# EAGLE design spdif_B (EAGLE 7.7.0)

## Sheet 1 of 2
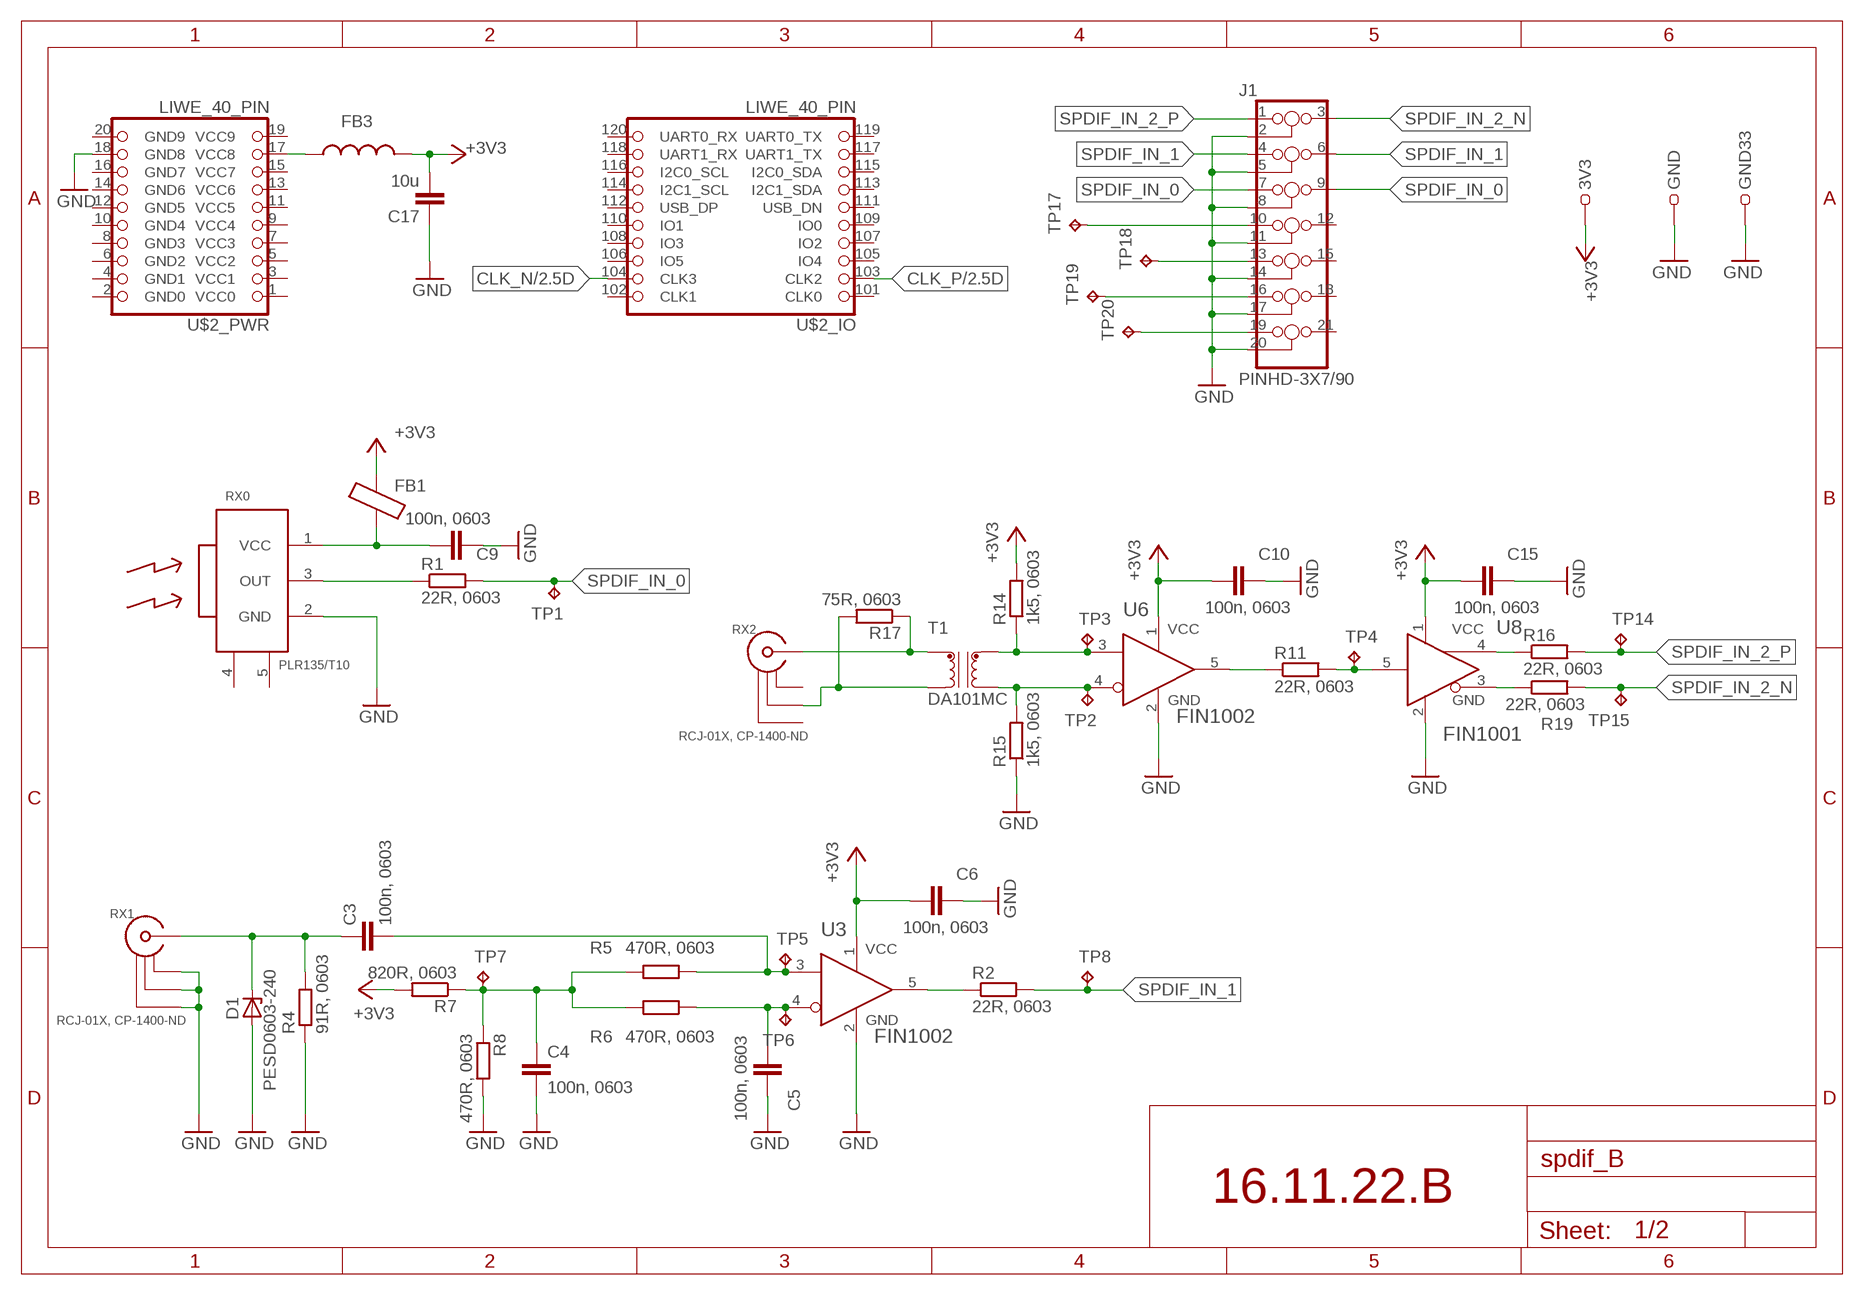
[diagram p0: schematic, sheet 1]

### Parts
3V3  TEST-22-MULTICOMP  [TEST_1MM]
C3  100n, 0603  C-EUC0603  [C0603]
C4  100n, 0603  C-EUC0603  [C0603]
C5  100n, 0603  C-EUC0603  [C0603]
C6  100n, 0603  C-EUC0603  [C0603]
C9  100n, 0603  C-EUC0603  [C0603]
C10  100n, 0603  C-EUC0603  [C0603]
C15  100n, 0603  C-EUC0603  [C0603]
C17  10u  C-EUC0805  [C0805]
D1  PESD0603-240  ZDPESD0603-240  [L0603]
FB1  FB_0603  [L0603]
FB3  L0603(1608)  [L0603]
GND  TEST-22-MULTICOMP  [TEST_1MM]
GND33  TEST-22-MULTICOMP  [TEST_1MM]
J1  PINHD-3X7/90  [3X07/90]
R1  22R, 0603  R-EU_R0603  [R0603]
R2  22R, 0603  R-EU_R0603  [R0603]
R4  91R, 0603  R-EU_R0603  [R0603]
R5  470R, 0603  R-EU_R0603  [R0603]
R6  470R, 0603  R-EU_R0603  [R0603]
R7  820R, 0603  R-EU_R0603  [R0603]
R8  470R, 0603  R-EU_R0603  [R0603]
R11  22R, 0603  R-EU_R0603  [R0603]
R14  1k5, 0603  R-EU_R0603  [R0603]
R15  1k5, 0603  R-EU_R0603  [R0603]
R16  22R, 0603  R-EU_R0603  [R0603]
R17  75R, 0603  R-EU_R0603  [R0603]
R19  22R, 0603  R-EU_R0603  [R0603]
RX0  PLR135/T10  PLR135_T10  [PLR135_T10]
RX1  RCJ-01X, CP-1400-ND  RCJ-01X  [RCJ-01X]
RX2  RCJ-01X, CP-1400-ND  RCJ-01X  [RCJ-01X]
T1  DA101MC  [DA101MC]
TP1  TPB1,27  [B1,27]
TP2  TPB1,27  [B1,27]
TP3  TPB1,27  [B1,27]
TP4  TPB1,27  [B1,27]
TP5  TPB1,27  [B1,27]
TP6  TPB1,27  [B1,27]
TP7  TPB1,27  [B1,27]
TP8  TPB1,27  [B1,27]
TP14  TPB1,27  [B1,27]
TP15  TPB1,27  [B1,27]
TP17  TPB1,27  [B1,27]
TP18  TPB1,27  [B1,27]
TP19  TPB1,27  [B1,27]
TP20  TPB1,27  [B1,27]
U3  FIN1002  [SOT95P280X140-5N]
U6  FIN1002  [SOT95P280X140-5N]
U8  FIN1001  [SOT95P280X140-5N]
U$2  LIWE_40_PIN  [LIWE_40_PIN_8X8]

### Nets
+3V3: 3V3.1 C6.2 C10.2 C15.2 C17.2 FB1.2 FB3.2 R7.2 R14.2 U3.1(VCC) U6.1(VCC) U8.1(VCC) ; also sheet 2
CLK_N: U$2.104(_IO:CLK3) ; also sheet 2
CLK_P: U$2.103(_IO:CLK2) ; also sheet 2
GND: C4.2 C5.1 C6.1 C9.1 C10.1 C15.1 C17.1 D1.1(A) GND33.1 GND.1 J1.2 J1.5 J1.8 J1.11 J1.14 J1.17 J1.20 R4.1 R8.2 R15.1 RX0.2(GND) RX1.20(GND1) RX1.21(GND2) RX1.22(GND3) U3.2(GND) U6.2(GND) U8.2(GND) U$2.18(_PWR:GND8) ; also sheet 2
N$1: R11.2 TP4.TP U8.5(RIN)
N$2: R16.1 U8.4(ROUT+)
N$3: R2.1 U3.5(ROUT)
N$4: C3.2 R5.1 TP5.TP U3.3(RIN+)
N$5: C9.2 FB1.1 RX0.1(VCC)
N$6: C3.1 D1.2(C) R4.2 RX1.1(SIG)
N$7: R19.1 U8.3(ROUT-)
N$11: C4.1 R5.2 R6.2 R7.1 R8.1 TP7.TP
N$12: C5.2 R6.1 TP6.TP U3.4(RIN-)
N$14: J1.10 TP17.TP
N$16: R15.2 T1.4 TP2.TP U6.4(RIN-)
N$17: R14.1 T1.6 TP3.TP U6.3(RIN+)
N$18: J1.13 TP18.TP
N$19: J1.16 TP19.TP
N$20: R17.2 RX2.21(GND2) T1.3
N$21: R17.1 RX2.1(SIG) T1.1
N$22: J1.19 TP20.TP
N$23: FB3.1 U$2.17(_PWR:VCC8)
SPDIF0_IN: R1.1 RX0.3(OUT)
SPDIF_IN_0: J1.7 J1.9 R1.2 TP1.TP
SPDIF_IN_1: J1.4 J1.6 R2.2 TP8.TP
SPDIF_IN_2_N: J1.3 R19.2 TP15.TP
SPDIF_IN_2_P: J1.1 R16.2 TP14.TP
U6_OUT: R11.1 U6.5(ROUT)
Unconnected: J1.12 J1.15 J1.18 J1.21 RX0.4(NC0) RX0.5(NC1) RX2.20(GND1) RX2.22(GND3) U$2.1(_PWR:VCC0) U$2.2(_PWR:GND0) U$2.3(_PWR:VCC1) U$2.4(_PWR:GND1) U$2.5(_PWR:VCC2) U$2.6(_PWR:GND2) U$2.7(_PWR:VCC3) U$2.8(_PWR:GND3) U$2.9(_PWR:VCC4) U$2.10(_PWR:GND4) U$2.11(_PWR:VCC5) U$2.12(_PWR:GND5) U$2.13(_PWR:VCC6) U$2.14(_PWR:GND6) U$2.15(_PWR:VCC7) U$2.16(_PWR:GND7) U$2.19(_PWR:VCC9) U$2.20(_PWR:GND9) U$2.101(_IO:CLK0) U$2.102(_IO:CLK1) U$2.105(_IO:IO4) U$2.106(_IO:IO5) U$2.107(_IO:IO2) U$2.108(_IO:IO3) U$2.109(_IO:IO0) U$2.110(_IO:IO1) U$2.111(_IO:USB_DN) U$2.112(_IO:USB_DP) U$2.113(_IO:I2C1_SDA) U$2.114(_IO:I2C1_SCL) U$2.115(_IO:I2C0_SDA) U$2.116(_IO:I2C0_SCL) U$2.117(_IO:UART1_TX) U$2.118(_IO:UART1_RX) U$2.119(_IO:UART0_TX) U$2.120(_IO:UART0_RX)

### Notes on the sheet
- 16.11.22.B

## Sheet 2 of 2
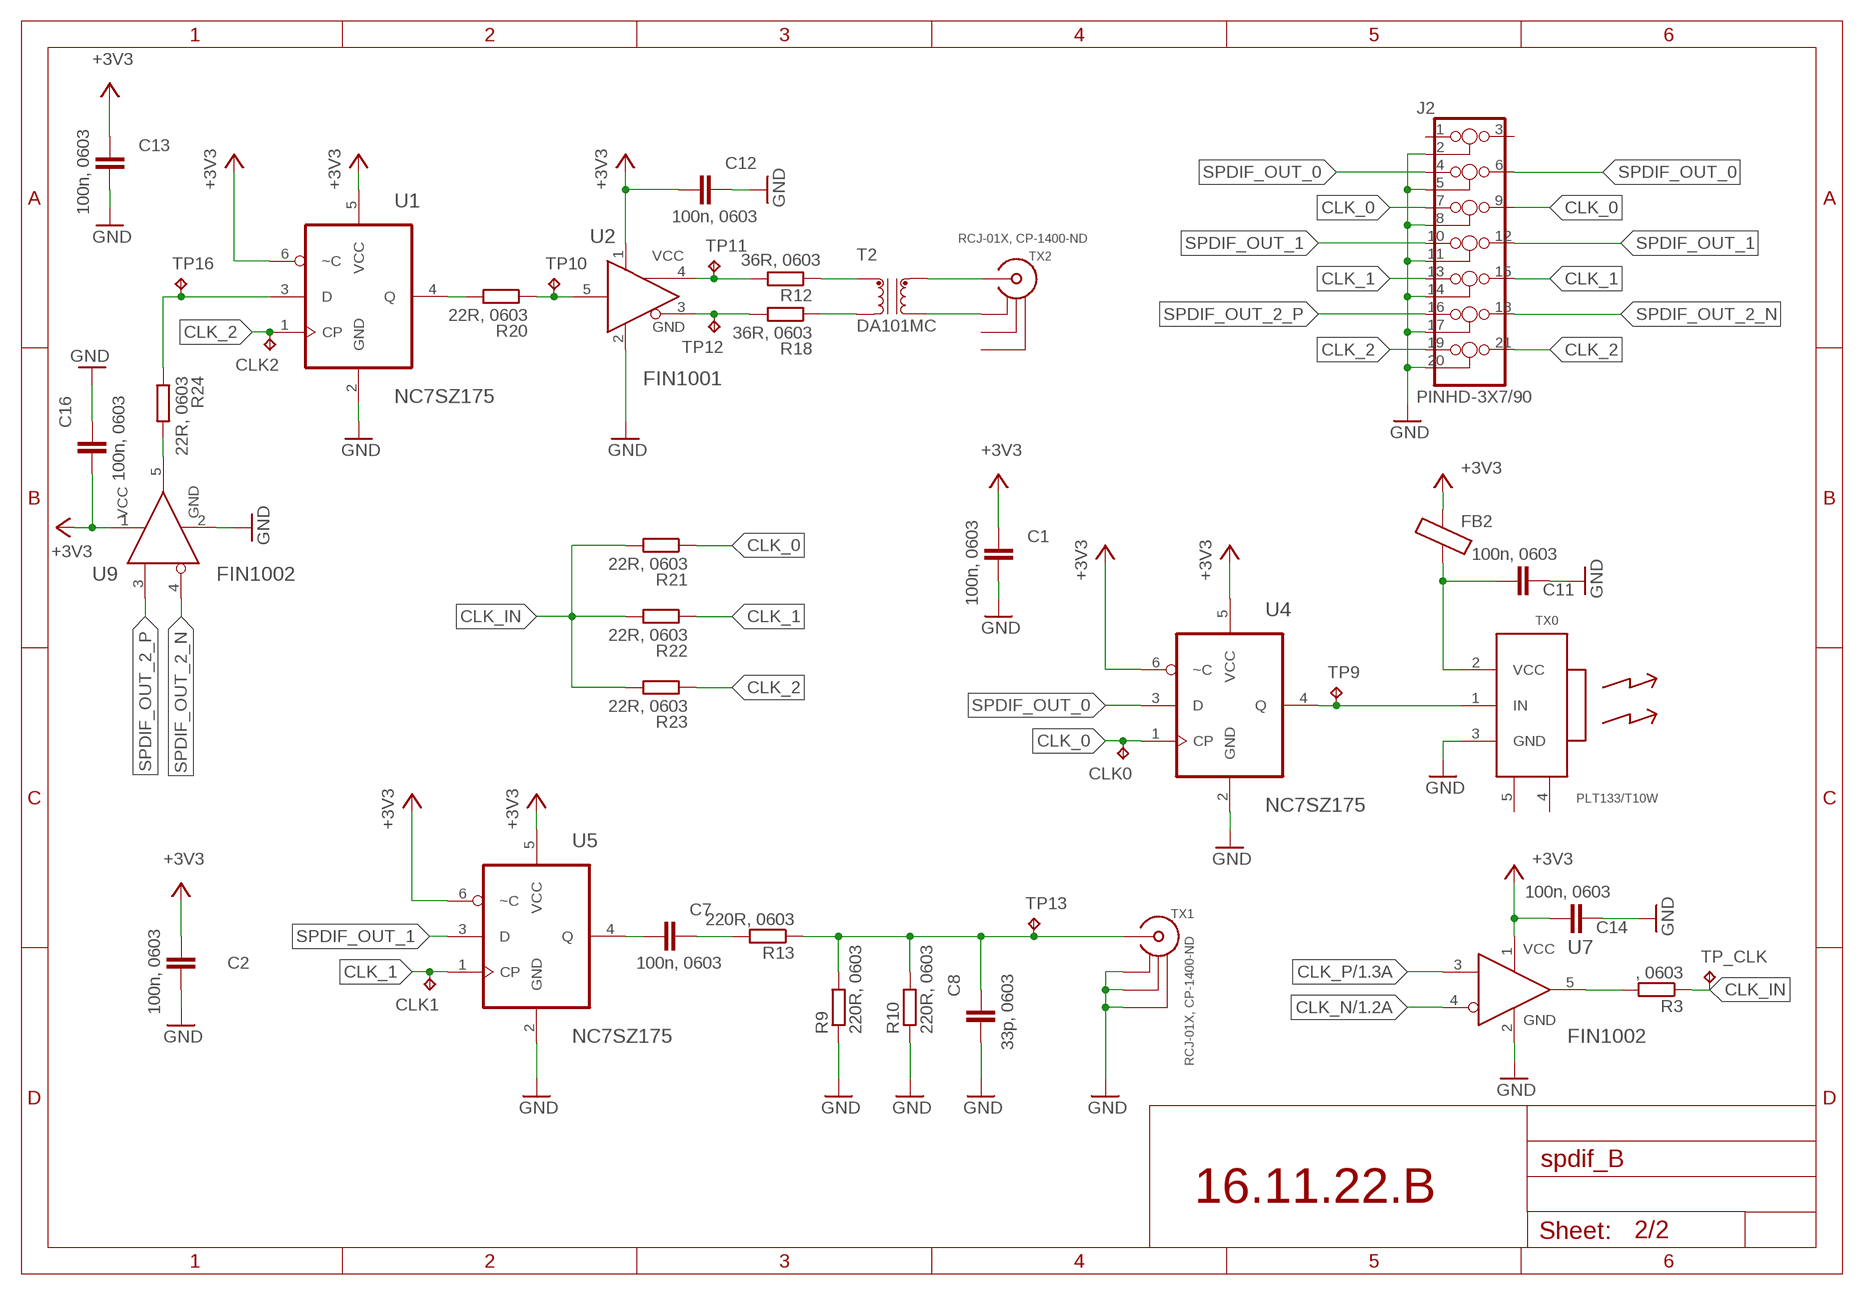
[diagram p1: schematic, sheet 2]

### Parts
C1  100n, 0603  C-EUC0603  [C0603]
C2  100n, 0603  C-EUC0603  [C0603]
C7  100n, 0603  C-EUC0603  [C0603]
C8  33p, 0603  C-EUC0603  [C0603]
C11  100n, 0603  C-EUC0603  [C0603]
C12  100n, 0603  C-EUC0603  [C0603]
C13  100n, 0603  C-EUC0603  [C0603]
C14  100n, 0603  C-EUC0603  [C0603]
C16  100n, 0603  C-EUC0603  [C0603]
CLK0  TPB1,27  [B1,27]
CLK1  TPB1,27  [B1,27]
CLK2  TPB1,27  [B1,27]
FB2  FB_0603  [L0603]
J2  PINHD-3X7/90  [3X07/90]
R3  , 0603  R-EU_R0603  [R0603]
R9  220R, 0603  R-EU_R0603  [R0603]
R10  220R, 0603  R-EU_R0603  [R0603]
R12  36R, 0603  R-EU_R0603  [R0603]
R13  220R, 0603  R-EU_R0603  [R0603]
R18  36R, 0603  R-EU_R0603  [R0603]
R20  22R, 0603  R-EU_R0603  [R0603]
R21  22R, 0603  R-EU_R0603  [R0603]
R22  22R, 0603  R-EU_R0603  [R0603]
R23  22R, 0603  R-EU_R0603  [R0603]
R24  22R, 0603  R-EU_R0603  [R0603]
T2  DA101MC  [DA101MC]
TP9  TPB1,27  [B1,27]
TP10  TPB1,27  [B1,27]
TP11  TPB1,27  [B1,27]
TP12  TPB1,27  [B1,27]
TP13  TPB1,27  [B1,27]
TP16  TPB1,27  [B1,27]
TP_CLK  TPB1,27  [B1,27]
TX0  PLT133/T10W  PLT133_T10W  [PLT133_T10W]
TX1  RCJ-01X, CP-1400-ND  RCJ-01X  [RCJ-01X]
TX2  RCJ-01X, CP-1400-ND  RCJ-01X  [RCJ-01X]
U1  NC7SZ175  [SOT65P210X110-6N]
U2  FIN1001  [SOT95P280X140-5N]
U4  NC7SZ175  [SOT65P210X110-6N]
U5  NC7SZ175  [SOT65P210X110-6N]
U7  FIN1002  [SOT95P280X140-5N]
U9  FIN1002  [SOT95P280X140-5N]

### Nets
+3V3: C1.2 C2.2 C12.2 C13.2 C14.2 C16.2 FB2.2 U1.5(VCC) U1.6(~C) U2.1(VCC) U4.5(VCC) U4.6(~C) U5.5(VCC) U5.6(~C) U7.1(VCC) U9.1(VCC) ; also sheet 1
CLK_0: CLK0.TP J2.7 J2.9 R21.1 U4.1(CP)
CLK_1: CLK1.TP J2.13 J2.15 R22.1 U5.1(CP)
CLK_2: CLK2.TP J2.19 J2.21 R23.1 U1.1(CP)
CLK_IN: R3.1 R21.2 R22.2 R23.2 TP_CLK.TP
CLK_N: U7.4(RIN-) ; also sheet 1
CLK_P: U7.3(RIN+) ; also sheet 1
DA_N: R18.1 T2.3
DA_P: R12.1 T2.1
FIN_IN: R20.1 TP10.TP U2.5(RIN)
FIN_OUT_N: R18.2 TP12.TP U2.3(ROUT-)
FIN_OUT_P: R12.2 TP11.TP U2.4(ROUT+)
GND: C1.1 C2.1 C8.2 C11.1 C12.1 C13.1 C14.1 C16.1 J2.2 J2.5 J2.8 J2.11 J2.14 J2.17 J2.20 R9.1 R10.1 TX0.3(GND) TX1.20(GND1) TX1.21(GND2) TX1.22(GND3) U1.2(GND) U2.2(GND) U4.2(GND) U5.2(GND) U7.2(GND) U9.2(GND) ; also sheet 1
N$8: R24.2 U9.5(ROUT)
N$9: R3.2 U7.5(ROUT)
N$10: R24.1 TP16.TP U1.3(D)
N$13: C7.1 R13.2
N$15: C7.2 U5.4(Q)
Q: R20.2 U1.4(Q)
SPDIF_OUT_0: J2.4 J2.6 U4.3(D)
SPDIF_OUT_1: J2.10 J2.12 U5.3(D)
SPDIF_OUT_2_N: J2.18 U9.4(RIN-)
SPDIF_OUT_2_P: J2.16 U9.3(RIN+)
TX0_IN: TP9.TP TX0.1(IN) U4.4(Q)
TX0_VCC: C11.2 FB2.1 TX0.2(VCC)
TX1_IN: C8.1 R9.2 R10.2 R13.1 TP13.TP TX1.1(SIG)
TX2_N: T2.4 TX2.20(GND1)
TX2_P: T2.6 TX2.1(SIG)
Unconnected: J2.1 J2.3 TX0.4(NC0) TX0.5(NC1) TX2.21(GND2) TX2.22(GND3)

### Notes on the sheet
- 16.11.22.B

## Library data of the parts
3V3 GND GND33 = 25cmsquare:TEST-22-MULTICOMP: MULTICOMP TEST-22 TEST PIN, PCB, 1.0MM FARNELL: 1702010
C1-C17 = rcl:C-EU: CAPACITOR, European symbol
CLK0 CLK1 CLK2 TP1-TP20 TP_CLK = testpad:TP: Test pad
D1 = 25cmsquare:ZD
FB1 FB2 = 25cmsquare:FB
FB3 = 25cmsquare:L
J1 J2 = 25pinhead:PINHD-3X7
R1-R24 = rcl:R-EU_: RESISTOR, European symbol
RX0 = 25cmsquare:PLR135_T10
RX1 RX2 TX1 TX2 = 25cmsquare:RCJ-01X
T1 T2 = 25cmsquare:DA
TX0 = 25cmsquare:PLT133_T10W
U1 U4 U5 = 25cmsquare:NC7SZ175
U2 U8 = 25cmsquare:FIN1001
U3 U6 U7 U9 = 25cmsquare:FIN1002
U$2 = 25cmsquare:LIWE_40_PIN

## Board
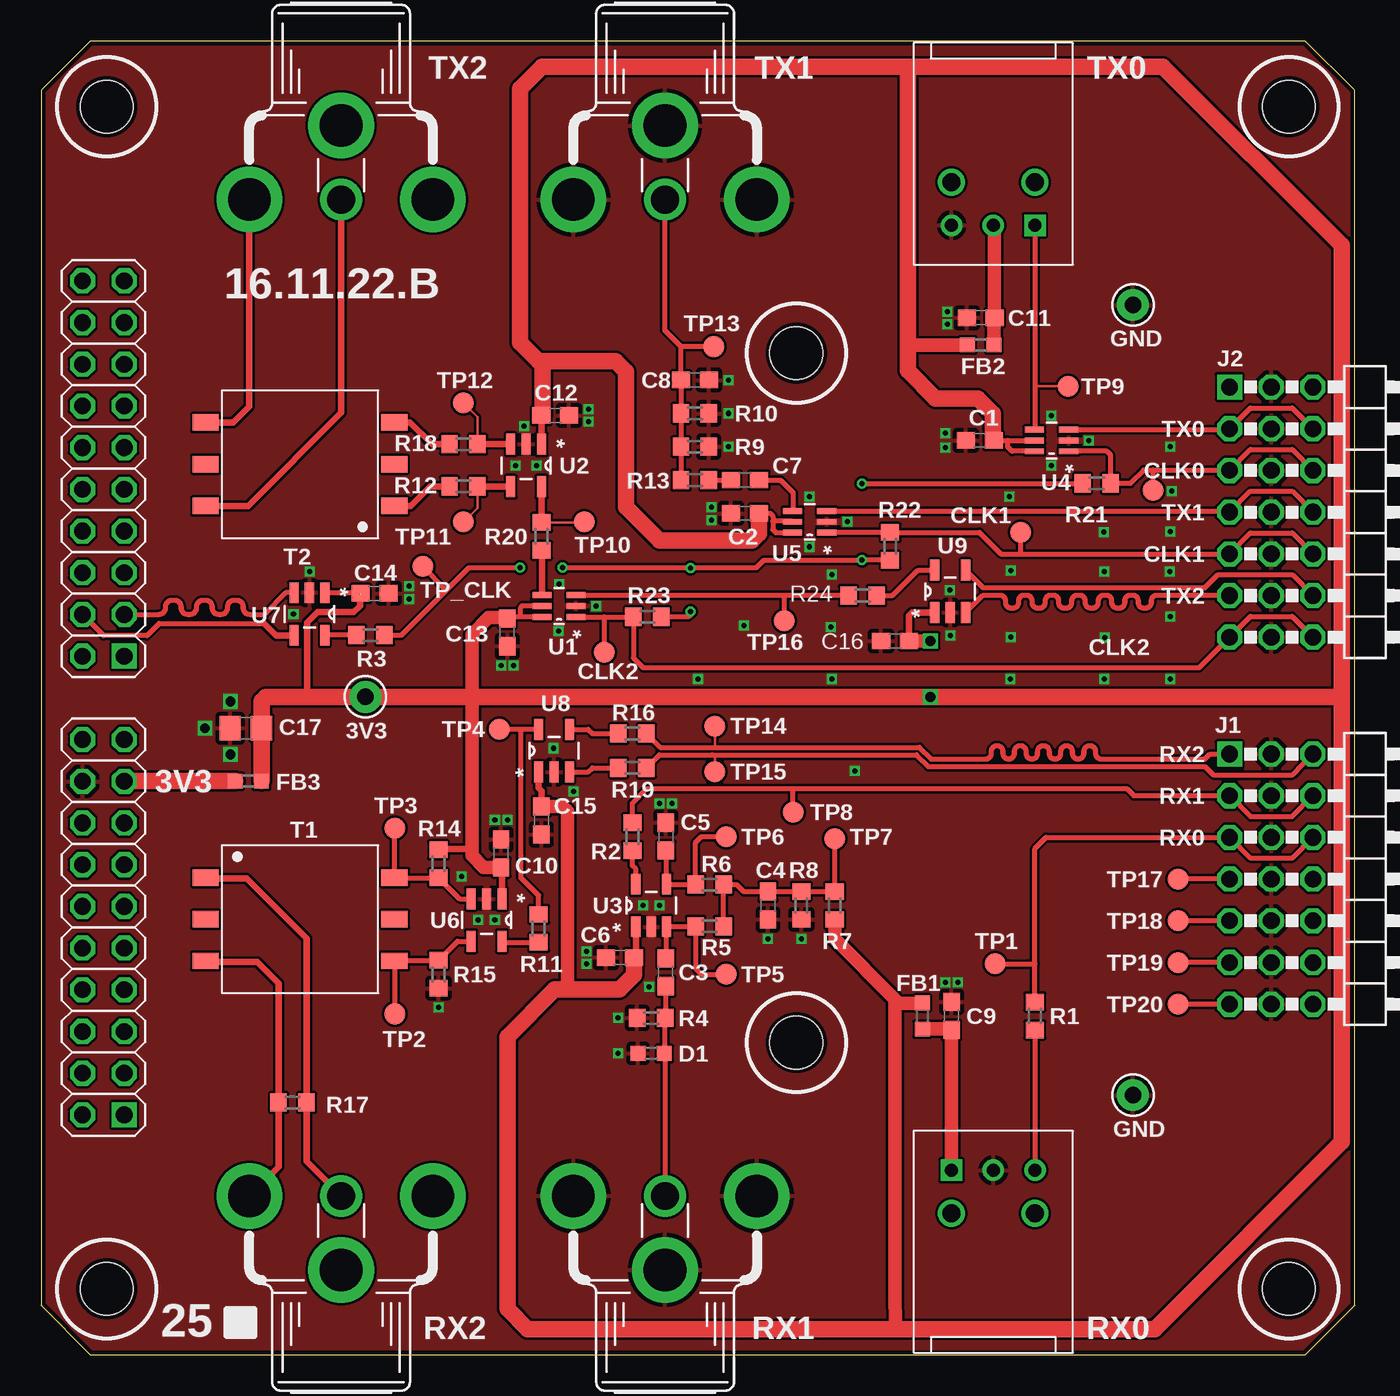
[diagram p2: board, top side]
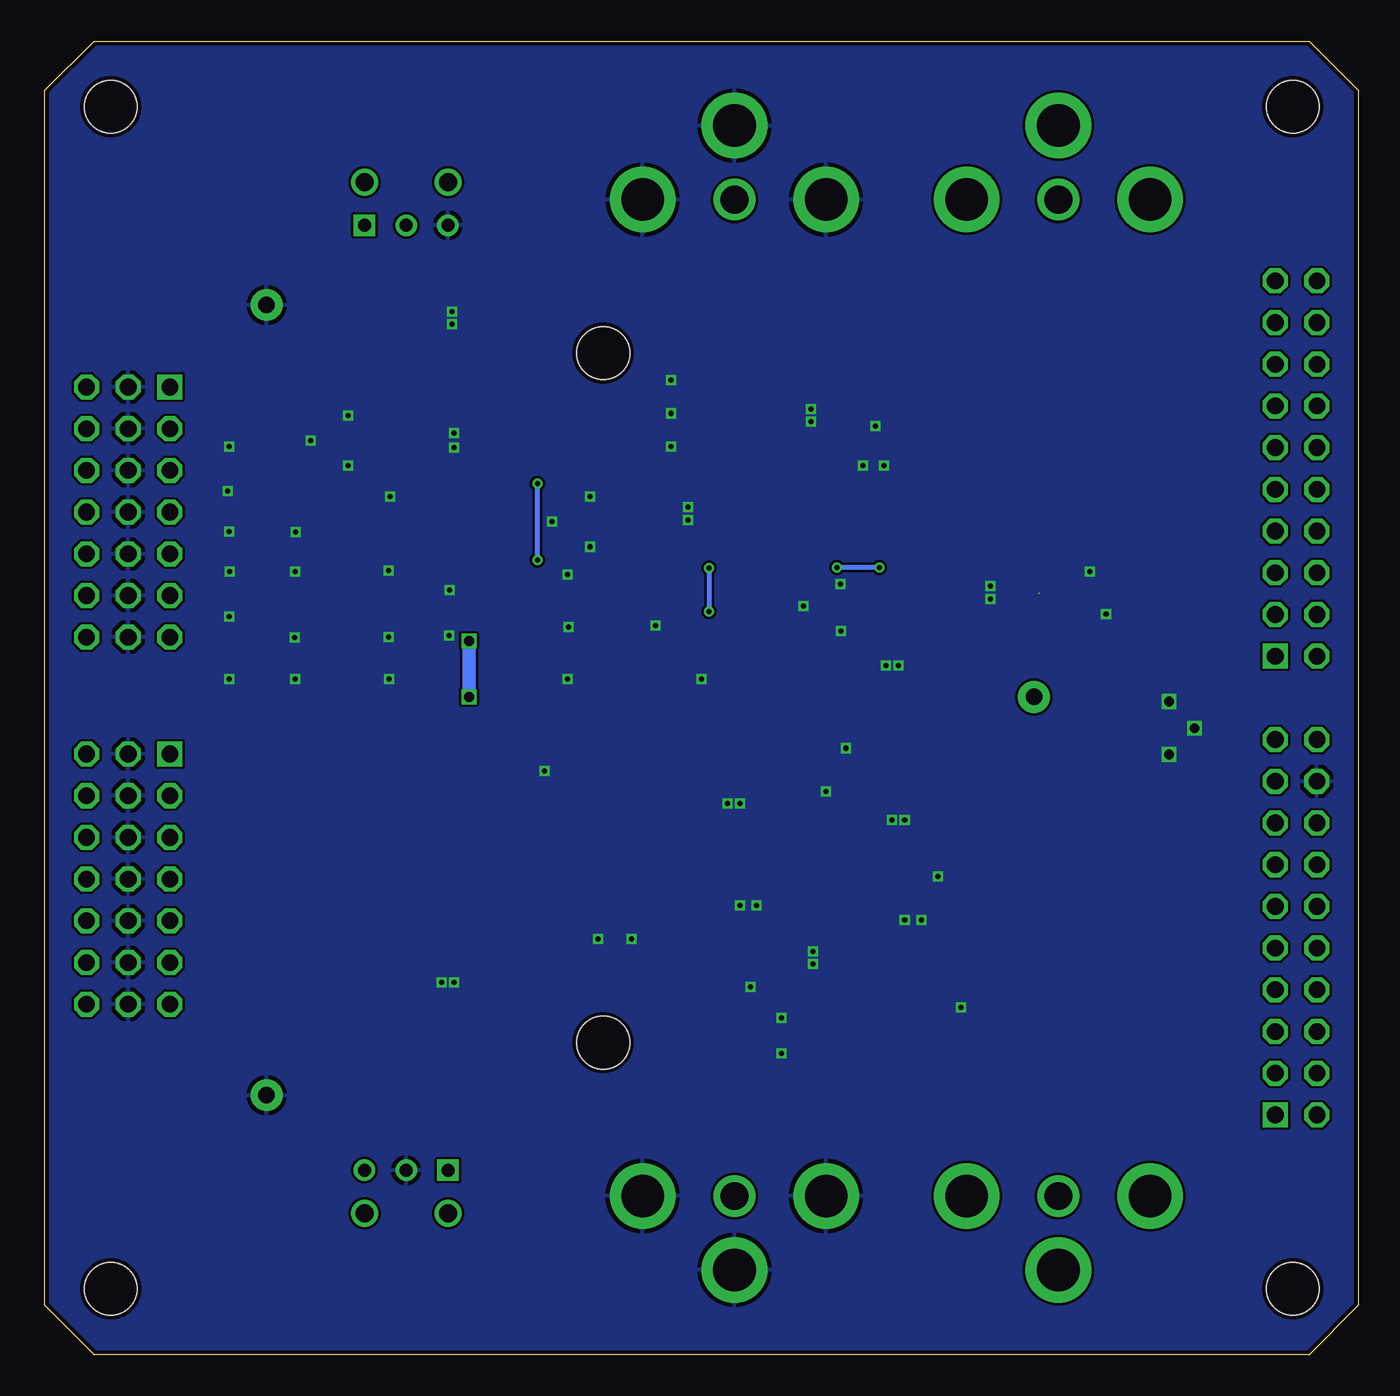
[diagram p3: board, bottom side, seen from below]

Size 80 x 80 mm. Coordinates in mm from the lower left corner, seen from the top.
Copper layers (1*16): Top 0.035mm / dielectric 1.5mm / Bottom 0.035mm
Design rules "SeeedStudio_2layer_DRU_no_angle_20140221": minimum track width 6mil, minimum drill 12mil, track to track 6mil, track to pad 6mil, pad to pad 6mil, via to via 6mil, smd to smd 0mil, copper to edge 10mil, drill to drill 10mil, minimum pad ring 10mil, minimum via ring 6mil, stop-mask expansion 2mil, vias tented up to drill 100mil, thermal gap 10mil

### Footprints (pad centres in the part's own frame; a part is rotated, then mirrored left to right if it is on the bottom)
TEST_1MM = drill 1 pad 1.93: 1 0,0
C0603 = smd 1.1 x 1: 1 -0.85,0; 2 0.85,0
C0805 = smd 1.3 x 1.5: 1 -0.95,0; 2 0.95,0
B1,27 = smd 1.27 x 1.27: TP 0,0
L0603 = smd 0.9 x 0.9: 1 -0.8,0; 2 0.8,0
3X07/90 = drill 1.016 square: 1 -7.62,-8.89 | drill 1.016 octagon: 2 -7.62,-6.35; 3 -7.62,-3.81; 4 -5.08,-8.89; 5 -5.08,-6.35; 6 -5.08,-3.81; 7 -2.54,-8.89; 8 -2.54,-6.35; 9 -2.54,-3.81; 10 0,-8.89; 11 0,-6.35; 12 0,-3.81; 13 2.54,-8.89; 14 2.54,-6.35; 15 2.54,-3.81; 16 5.08,-8.89; 17 5.08,-6.35; 18 5.08,-3.81; 19 7.62,-8.89; 20 7.62,-6.35; 21 7.62,-3.81
R0603 = smd 1 x 1.1: 1 -0.85,0; 2 0.85,0
PLR135_T10 = drill 0.8 square: 1 2.54,0 | drill 0.8: 2 0,0; 3 -2.54,0 | drill 1.1: 4 2.54,2.62; 5 -2.54,2.62
RCJ-01X = drill 1.7 pad 2.54: 1 0,0 | drill 2.6 pad 4: 20 -5.588,0; 21 5.588,0; 22 0,4.5
DA101MC = smd 1.6 x 1: 1 -5.75,2.54; 2 -5.75,0; 3 -5.75,-2.54; 4 5.75,-2.54; 5 5.75,0; 6 5.75,2.54
PLT133_T10W = drill 0.8 square: 1 2.54,0 | drill 0.8: 2 0,0; 3 -2.54,0 | drill 1.1: 4 2.54,2.63; 5 -2.54,2.63
SOT65P210X110-6N = smd 1.168 x 0.356: 1 -1.041,0.66; 2 -1.041,0; 3 -1.041,-0.66; 4 1.041,-0.66; 5 1.041,0; 6 1.041,0.66
SOT95P280X140-5N = smd 1.27 x 0.559: 1 -1.295,0.94; 2 -1.295,0; 3 -1.295,-0.94; 4 1.295,-0.94; 5 1.295,0.94
LIWE_40_PIN_8X8 = drill 1.016 square: 1 74.93,65.405; 101 74.93,37.465 | drill 1.016 octagon: 2 77.47,65.405; 3 74.93,62.865; 4 77.47,62.865; 5 74.93,60.325; 6 77.47,60.325; 7 74.93,57.785; 8 77.47,57.785; 9 74.93,55.245; 10 77.47,55.245; 11 74.93,52.705; 12 77.47,52.705; 13 74.93,50.165; 14 77.47,50.165; 15 74.93,47.625; 16 77.47,47.625; 17 74.93,45.085; 18 77.47,45.085; 19 74.93,42.545; 20 77.47,42.545; 102 77.47,37.465; 103 74.93,34.925; 104 77.47,34.925; 105 74.93,32.385; 106 77.47,32.385; 107 74.93,29.845; 108 77.47,29.845; 109 74.93,27.305; 110 77.47,27.305; 111 74.93,24.765; 112 77.47,24.765; 113 74.93,22.225; 114 77.47,22.225; 115 74.93,19.685; 116 77.47,19.685; 117 74.93,17.145; 118 77.47,17.145; 119 74.93,14.605; 120 77.47,14.605 | hole 3.2: 34,19; 34,61; 4,76; 4,4; 76,4; 76,76

### Placement (x,y rotation side)
3V3  19.76,40.05 0 top
C1  57.17,55.67 0 top
C2  42.87,51.23 0 top
C3  38.05,23.29 90 top
C4  44.27,27.35 270 top
C5  38.05,31.54 270 top
C6  35.26,24.18 0 top
C7  42.88,53.26 0 top
C8  39.83,59.36 0 top
C9  55.45,20.62 270 top
C10  28.02,30.53 270 top
C11  57.23,63.14 0 top
C12  31.32,57.2 180 top
C13  28.4,43.99 90 top
C14  20.32,46.35 180 top
C15  30.48,32.54 90 top
C16  52.02,43.46 0 top
C17  12.47,38.15 0 top
CLK0  67.74,52.63 0 top
CLK1  59.66,50.09 0 top
CLK2  34.32,42.77 0 top
D1  37.16,18.34 0 top
FB1  53.67,20.62 90 top
FB2  57.23,61.49 180 top
FB3  12.62,34.92 0 top
GND  66.5,15.79 0 top
GND33  66.5,63.93 0 top
J1  81.28,28.96 270 top
J2  81.28,51.31 270 top
R1  60.53,20.62 90 top
R2  36.02,31.54 90 top
R3  20.07,43.81 180 top
R4  37.16,20.49 0 top
R5  40.72,26.08 0 top
R6  40.72,28.62 0 top
R7  48.34,27.35 270 top
R8  46.31,27.35 270 top
R9  39.83,55.29 180 top
R10  39.83,57.32 180 top
R11  30.3,25.95 90 top
R12  25.73,52.88 0 top
R13  39.83,53.26 0 top
R14  24.21,29.89 90 top
R15  24.21,23.16 90 top
R16  36.02,37.82 0 top
R17  15.32,15.35 180 top
R18  25.73,55.44 0 top
R19  36.02,35.74 0 top
R20  30.48,49.83 270 top
R21  64.29,53.06 180 top
R22  51.71,49.23 270 top
R23  36.93,44.93 0 top
R24  50.04,46.23 0 top
RX0  58,11.22 180 top
RX1  38.01,9.65 180 top
RX2  18.27,9.65 180 top
T1  15.78,26.51 0 top
T2  15.78,54.22 180 top
TP1  58.12,23.8 0 top
TP2  21.54,20.75 0 top
TP3  21.54,32.05 0 top
TP4  27.91,38.07 0 top
TP5  41.73,23.16 0 top
TP6  41.73,31.54 0 top
TP7  48.34,31.42 0 top
TP8  45.8,33.04 0 top
TP9  62.56,58.98 0 top
TP10  33.1,50.72 0 top
TP11  25.73,50.72 0 top
TP12  25.73,57.96 0 top
TP13  40.97,61.39 0 top
TP14  41.05,38.28 0 top
TP15  41.05,35.48 0 top
TP16  45.26,44.68 0 top
TP17  69.27,28.96 0 top
TP18  69.27,26.42 0 top
TP19  69.27,23.88 0 top
TP20  69.27,21.34 0 top
TP_CLK  23.24,48.01 0 top
TX0  58,68.78 0 top
TX1  38.01,70.35 0 top
TX2  18.27,70.35 0 top
U1  31.55,45.59 180 top
U2  29.54,54.15 270 top
U3  37.16,27.35 90 top
U4  61.55,55.67 180 top
U5  46.81,50.72 180 top
U6  27.13,26.46 270 top
U7  16.35,45.1 270 top
U8  31.24,36.78 90 top
U9  55.37,46.48 90 top
U$2  80,80 180 top

### Tracks (layer width: path | path; a pad name or v marks a point on that pad's centre or on a via)
+3V3  (via drill 0.6)  (1 unrouted)
  Top 0.254: 52.73,78.51 52.73,78.45
  Top 0.305: U1.6 29.18,44.93 | 29.18,44.93 28.11,44.93 C13.2 | 26.24,43.86 26.24,40.13 | U7.1 19.43,46.4 C14.2 | C2.2 44.42,51.23 44.58,51.08 44.58,50.75 | 44.58,50.75 44.58,50.24 44.76,50.06 U5.6 | U5.5 45.74,50.75 44.58,50.75 | U1.5 29.31,45.59 29.18,45.47 29.18,44.93 | C1.2 58.88,55.67 | 58.88,55.67 U4.5 | U4.6 59.13,55.02 58.88,55.27 58.88,55.67
  Top 0.406: U2.1 30.47,55.46 C12.2 | R14.2 24.25,30.78 26.24,30.78 | C10.2 28.07,29.63 U6.1 | U3.1 36.22,24.14 C6.2 | 19.43,46.35 19.43,45.59 19.05,45.21 16.84,45.21 16.2,44.58 16.2,40.13 15.68,40.13 15.6,40.05 | U8.1 30.3,34.49 30.48,34.31 C15.2 | U9.1 53.03,45.19 52.86,45.01 52.86,43.47 C16.2
  Top 0.813: C13.2 27.98,44.88 27.26,44.88 26.24,43.86 26.24,40.05 26.24,30.78 26.24,30.4 26.96,29.68 C10.2 | R7.2 48.34,25.32 52.02,21.64 52.02,21.38 | 52.02,21.38 52.02,3.97 52.03,1.55 | FB1.2 53.63,21.38 52.02,21.38 | 52.78,60.85 52.78,61.49 FB2.2 | C15.2 31.74,33.39 32.05,33.07 32.05,22.23 | C16.2 v54.18,43.46
  Top 1.016: 79.22,40.05 v54.18,40.05 26.24,40.05 3V3.1 15.6,40.05 13.69,40.05 13.44,39.8 13.44,38.17 C17.2 FB3.2 | 30.56,60.5 30.3,60.5 29.16,61.64 29.16,77.1 30.51,78.45 52.73,78.45 | 30.56,60.5 35,60.5 35.64,59.86 35.64,51.61 37.67,49.58 43.31,49.58 43.72,49.99 C2.2 | C12.2 30.56,57.24 30.56,60.5 | C6.2 36.11,23.12 35.22,22.23 32.05,22.23 31.28,22.23 28.4,19.35 28.4,2.77 29.62,1.55 52.03,1.55 67.83,1.55 79.22,12.95 79.22,40.05 | 79.22,40.05 79.22,67.56 68.34,78.45 52.73,78.45 | 52.73,78.45 52.7,78.44 52.78,78.36 52.78,60.85 52.78,59.92 54.48,58.22 57.07,58.22 57.99,57.3 57.99,55.71 C1.2
  Bottom 0.813: v54.18,43.46 v54.18,40.05
CLK_0
  Top 0.305: U4.1 64.93,55.01 65.13,54.81 65.13,53.07 | 72.35,53.81 J2.7 | J2.7 73.66,55.12 76.2,55.12 J2.9 | 65.13,53.07 R21.1 | 65.13,53.07 66.36,53.07 67.16,53.87 67.74,53.87 | 67.74,53.87 71.86,53.87 71.88,53.85 J2.7 | CLK0.TP 67.74,53.87
CLK_1
  Top 0.305: U5.1 51.7,50.06 R22.1 57.16,50.08 58.47,48.77 59.64,48.77 | 72.35,48.73 J2.13 | J2.13 73.66,50.04 76.2,50.04 J2.15 | 59.64,48.77 J2.13 | CLK1.TP 59.64,50.06 59.64,48.77
CLK_2
  Top 0.305: 72.35,43.65 J2.19 | J2.19 73.66,44.96 76.2,44.96 J2.21 | CLK2.TP 34.31,44.9 34.29,44.93 | U1.1 34.29,44.93 | 34.29,44.93 R23.1 36.08,42.43 36.68,41.83 70.54,41.83 J2.19
CLK_IN  (via drill 0.3)
  Top 0.305: R3.1 21.95,43.81 24.68,46.55 | 24.68,46.55 26.06,47.93 v29.18,47.93 | TP_CLK.TP 23.24,47.98 24.68,46.55 | v31.75,47.93 39.55,47.93 | 39.55,47.93 v39.55,47.9 | v39.55,45.26 39.55,45.05 39.43,44.93 R23.2 | 39.55,47.93 43.56,47.93 44.02,48.39 v50.01,48.39 R22.2 | v50.01,53.06 R21.2
  Bottom 0.305: v29.18,47.93 v31.75,47.93 | v39.55,47.9 v39.55,45.26 | v50.01,48.39 v50.01,53.06
CLK_N
  Top 0.305: 13.59,44.53 7.19,44.53 6.45,43.79 3.81,43.79 U$2.104
  Top 0.406: U7.4 14.31,43.81 13.59,44.53
CLK_P
  Top 0.305: U7.3 14.9,46.4 13.59,45.09 12.7,45.09 arc-90 12.31,45.48 12.31,45.55 arc90 11.91,45.94 11.76,45.94 arc90 11.36,45.55 11.36,45.48 arc-90 10.97,45.09 10.81,45.09 arc-90 10.42,45.48 10.42,45.55 arc90 10.02,45.94 9.87,45.94 arc90 9.47,45.55 9.47,45.48 arc-90 9.08,45.09 8.92,45.09 arc-90 8.53,45.48 8.53,45.55 arc90 8.13,45.94 7.98,45.94 arc90 7.58,45.55 7.58,45.48 arc-90 7.19,45.09 U$2.103
  Top 0.406: U$2.103
DA_N
  Top 0.406: T2.3 22.48,56.76 23.8,55.44 R18.1
DA_P
  Top 0.406: T2.1 22.51,51.68 23.7,52.88 R12.1
FIN_IN
  Top 0.152: TP10.TP 33.06,50.68 R20.1
  Top 0.406: U2.5 R20.1
FIN_OUT_N
  Top 0.152: R18.2 26.58,57.11 TP12.TP
  Top 0.406: U2.3 R18.2
FIN_OUT_P
  Top 0.152: TP11.TP 26.58,51.57 R12.2
  Top 0.406: U2.4 26.61,52.85 arc-90 R12.2
GND  (via drill 0.3, 0.6)
  other vias: 33.35,57.58 33.35,56.82 41.86,59.36 41.86,57.32 41.86,55.29 40.82,51.61 40.82,50.82 49.1,50.72 59.06,47.75 64.72,50.09 63.83,55.67 33.81,45.59 42.83,44.4 48.11,44.32 55.37,43.79 64.8,43.66 40.01,41.14 48.16,41.14 59.03,41.14 64.77,41.14 28.02,41.96 28.78,41.96 48.16,47.49 55.35,46.55 59.08,43.71 55.2,63.52 55.2,62.76 61.55,57.2 61.55,54.15 29.42,56.56 28.91,54.15 31.55,46.94 31.52,44.07 46.81,52.24 46.81,49.2 55.1,55.24 55.1,56.13 27.64,32.56 28.4,32.56 27.64,26.46 25.61,29.13 24.21,21.13 37.67,33.58 38.43,33.58 33.23,24.56 33.23,23.8 36.66,27.35 37.04,22.4 37.67,27.35 30.18,54.15 26.62,26.46 35.13,20.49 35.13,18.34 44.27,25.32 46.31,25.32 55.83,22.65 55.07,22.65 68.79,50.11 68.79,44.95 68.79,41.14 68.76,47.7 68.79,55.29 68.86,52.6 16.36,47.7 22.43,46.81 22.43,46.02 15.37,45.11 49.58,35.53 31.22,36.93 32.44,34.29 64.77,47.7 58.98,52.27 9.98,38.15 11.53,36.55 11.53,39.77
  pour Top (no thermals): 61.42,55.04 61.42,56.18 61.8,56.18 61.8,55.8 63.45,55.8 63.45,55.55 61.8,55.55 61.8,55.04
  pour Top (no thermals): 29.04,56.44 30.05,56.44 30.05,56.18 29.67,56.18 29.67,54.66 30.18,54.66 30.18,54.4 29.04,54.4 29.04,54.66 29.42,54.66 29.42,56.18 29.04,56.18
  pour Top (no thermals): 31.45,46.02 31.83,46.02 31.83,45.64 33.48,45.64 33.48,45.51 31.83,45.51 31.83,45.26 31.45,45.26
  pour Top (no thermals): 46.81,51.1 47.07,51.1 47.07,50.85 48.85,50.85 48.85,50.59 47.07,50.59 47.07,50.34 46.81,50.34
  pour Top (no thermals): 26.5,28.62 27,28.62 27,26.97 26.62,26.97 26.62,26.72 27.77,26.72 27.77,26.97 27.26,26.97 27.26,28.62 27.64,28.62 27.64,28.88 26.5,28.88
  pour Top (no thermals): 36.4,27.23 36.4,26.84 37.04,26.84 37.04,25.32 36.66,25.32 36.66,25.07 37.67,25.07 37.67,25.32 37.29,25.32 37.29,26.84 37.8,26.84 37.8,27.23
  pour Bottom: -0.32,80.52 -0.32,-0.2 80.58,-0.2 80.58,80.52
  pour Top: -2.26,80.9 81.18,80.9 81.18,0.53 81.18,-0.97 1.3,-0.97 -2.26,-0.97
N$1
  Top 0.254: 29.23,38.08 U8.5
  Top 0.305: R11.2 30.3,27.96 29.23,29.03 29.23,38.08 | U8.5 TP4.TP
N$2
  Top 0.305: U8.4 33.33,38.08 33.58,37.82 R16.1
N$3
  Top 0.305: U3.5 36.22,29.56 36.02,29.77 R2.1
N$4
  Top 0.305: 38.1,24.19 U3.3 | 38.13,26.08 R5.1 39.87,23.5 40.21,23.16 TP5.TP
  Top 0.406: C3.2 38.1,24.19 | U3.3 38.13,26.08
N$5
  Top 0.406: C9.2 55.4,19.82
  Top 0.813: C9.2 RX0.1 | 55.4,19.82 FB1.1
N$6
  Top 0.305: 38,18.3 38,18.29 38.01,18.28 RX1.1 | 38.01,18.39 R4.2 | 38.05,20.53 C3.1
  Top 0.406: 38,18.3 D1.2 38.01,18.39 | R4.2 38.05,20.53
N$7
  Top 0.305: U8.3 33.33,35.48 33.58,35.74 R19.1
N$8
  Top 0.305: R24.2 51.87,46.23 53.42,47.78 U9.5
N$9
  Top 0.305: R3.2 U7.5
N$10
  Top 0.305: U1.3 45.29,46.25 | 45.29,46.25 49.17,46.25 R24.1 | TP16.TP 45.29,44.68 45.29,46.25
N$11
  Top 0.305: R5.2 R6.2 42.37,28.62 42.79,28.2 C4.1 R8.1 R7.1 TP7.TP
N$12
  Top 0.305: 38.13,28.62 R6.1 39.87,31.2 40.21,31.54 TP6.TP | U3.4 38.1,30.69
  Top 0.406: U3.4 38.13,28.62 | 38.1,30.69 C5.2
N$13
  Top 0.305: R13.2 C7.1
N$14
  Top 0.305: J1.10 TP17.TP
N$15
  Top 0.152: 45.8,51.53 45.8,51.41 U5.4
  Top 0.305: C7.2 45.04,53.26 45.8,52.5 45.8,51.53
N$16
  Top 0.152: T1.4 21.54,23.96
  Top 0.305: R15.2 25.37,25.17 U6.4 | 24.17,23.97 T1.4 | 21.54,23.96 TP2.TP
  Top 0.406: R15.2 24.17,23.97
N$17
  Top 0.152: T1.6 21.54,29.07
  Top 0.305: T1.6 R14.1 25.49,27.76 U6.3 | 21.54,29.07 TP3.TP
  Top 0.406: T1.6
N$18
  Top 0.305: J1.13 TP18.TP
N$19
  Top 0.305: J1.16 TP19.TP
N$20
  Top 0.406: T1.3 10.08,23.92 13.16,23.92 14.47,22.61 R17.2 14.47,11.44 RX2.21
N$21
  Top 0.406: T1.1 10.08,29 12.53,29 16.17,25.36 R17.1 16.17,11.76 RX2.1
N$22
  Top 0.305: J1.19 TP20.TP
N$23
  Top 1.016: FB3.1 5.08,34.92 U$2.17
Q
  Top 0.305: 30.52,46.26 U1.4
  Top 0.406: R20.2 30.51,48.96 U1.4
SPDIF0_IN
  Top 0.305: R1.1 RX0.3
SPDIF_IN_0
  Top 0.305: R1.2 60.53,23.8 | TP1.TP 60.53,23.8 | 60.53,23.8 60.53,30.81 61.21,31.5 J1.7 73.64,30.25 76.22,30.25 J1.9
SPDIF_IN_1
  Top 0.152: 35.98,32.43 R2.2
  Top 0.254: TP8.TP
  Top 0.305: R2.2 36.02,33.58 36.91,34.46 45.8,34.46 | 45.8,34.46 66.12,34.46 66.55,34.04 J1.4 73.66,32.77 76.2,32.77 J1.6 | TP8.TP 45.8,34.46
SPDIF_IN_2_N
  Top 0.152: TP15.TP 41.05,36.37 40.89,36.52
  Top 0.305: R19.2 37.66,36.52 40.89,36.52 53.32,36.52 54.03,35.81 70.89,35.81 71.4,35.31 76.22,35.31 J1.3
SPDIF_IN_2_P
  Top 0.152: TP14.TP 41.05,37.01 41.02,36.98
  Top 0.305: R16.2 37.7,36.98 41.02,36.98 53.51,36.98 54.22,36.27 57.53,36.27 arc90 57.88,36.61 57.88,36.74 arc-90 58.22,37.08 58.24,37.08 arc-90 58.58,36.74 58.58,36.61 arc90 58.92,36.27 58.94,36.27 arc90 59.29,36.61 59.29,36.74 arc-90 59.63,37.08 59.65,37.08 arc-90 59.99,36.74 59.99,36.61 arc90 60.34,36.27 60.35,36.27 arc90 60.7,36.61 60.7,36.74 arc-90 61.04,37.08 61.06,37.08 arc-90 61.4,36.74 61.4,36.61 arc90 61.75,36.27 61.77,36.27 arc90 62.11,36.61 62.11,36.74 arc-90 62.45,37.08 62.47,37.08 arc-90 62.81,36.74 62.81,36.61 arc90 63.16,36.27 63.18,36.27 arc90 63.52,36.61 63.52,36.74 arc-90 63.86,37.08 63.88,37.08 arc-90 64.22,36.74 64.22,36.61 arc90 64.57,36.27 70.89,36.27 71.2,36.58 J1.1
SPDIF_OUT_0
  Top 0.305: U4.3 72.33,56.33 J2.4 73.66,57.66 76.2,57.66 J2.6
SPDIF_OUT_1
  Top 0.305: U5.3 72.32,51.38 J2.10 73.66,52.58 76.2,52.58 J2.12
SPDIF_OUT_2_N
  Top 0.305: U9.4 57.38,46.71 70.89,46.71 71.68,47.5 76.2,47.5 J2.18
SPDIF_OUT_2_P
  Top 0.305: U9.3 57.38,46.25 58.4,46.25 arc-90 58.74,45.91 58.74,45.81 arc90 59.08,45.47 59.2,45.47 arc90 59.55,45.81 59.55,45.91 arc-90 59.89,46.25 60.01,46.25 arc-90 60.35,45.91 60.35,45.81 arc90 60.7,45.47 60.82,45.47 arc90 61.16,45.81 61.16,45.91 arc-90 61.51,46.25 61.63,46.25 arc-90 61.97,45.91 61.97,45.81 arc90 62.31,45.47 62.44,45.47 arc90 62.78,45.81 62.78,45.91 arc-90 63.12,46.25 63.24,46.25 arc-90 63.59,45.91 63.59,45.81 arc90 63.93,45.47 64.05,45.47 arc90 64.39,45.81 64.39,45.91 arc-90 64.74,46.25 64.86,46.25 arc-90 65.2,45.91 65.2,45.81 arc90 65.55,45.47 65.67,45.47 arc90 66.01,45.81 66.01,45.91 arc-90 66.35,46.25 66.48,46.25 arc-90 66.82,45.91 66.82,45.81 arc90 67.16,45.47 67.28,45.47 arc90 67.63,45.81 67.63,45.91 arc-90 67.97,46.25 72.36,46.25 J2.16
TX0_IN
  Top 0.152: TP9.TP 60.67,58.98 60.54,58.85
  Top 0.305: TX0.1 60.54,58.85 60.54,56.37 U4.4
TX0_VCC
  Top 0.813: FB2.1 58.03,63.09 C11.2 58.08,68.8 TX0.2
TX1_IN
  Top 0.305: R13.1 R9.2 R10.2 C8.1 38.98,61.39 | 38.98,61.39 38,62.37 38,70.33 38.02,70.36 TX1.1 | TP13.TP 38.98,61.39
TX2_N
  Top 0.406: T2.4 11.71,56.76 12.68,57.74 TX2.20
TX2_P
  Top 0.406: T2.6 12.6,51.68 18.27,57.36 TX2.1
U6_OUT
  Top 0.305: 28.13,25.11 R11.1
  Top 0.406: U6.5 28.13,25.11

### Text on the board
tNames: 16.11.22.B | GND | TX0 | CLK0 | TX1 | CLK1 | TX2 | CLK2 | RX2 | 3V3 | RX1 | RX0 | 25